# EAGLE design VIC-20_Diag_Keyboard (EAGLE 9.5.2)
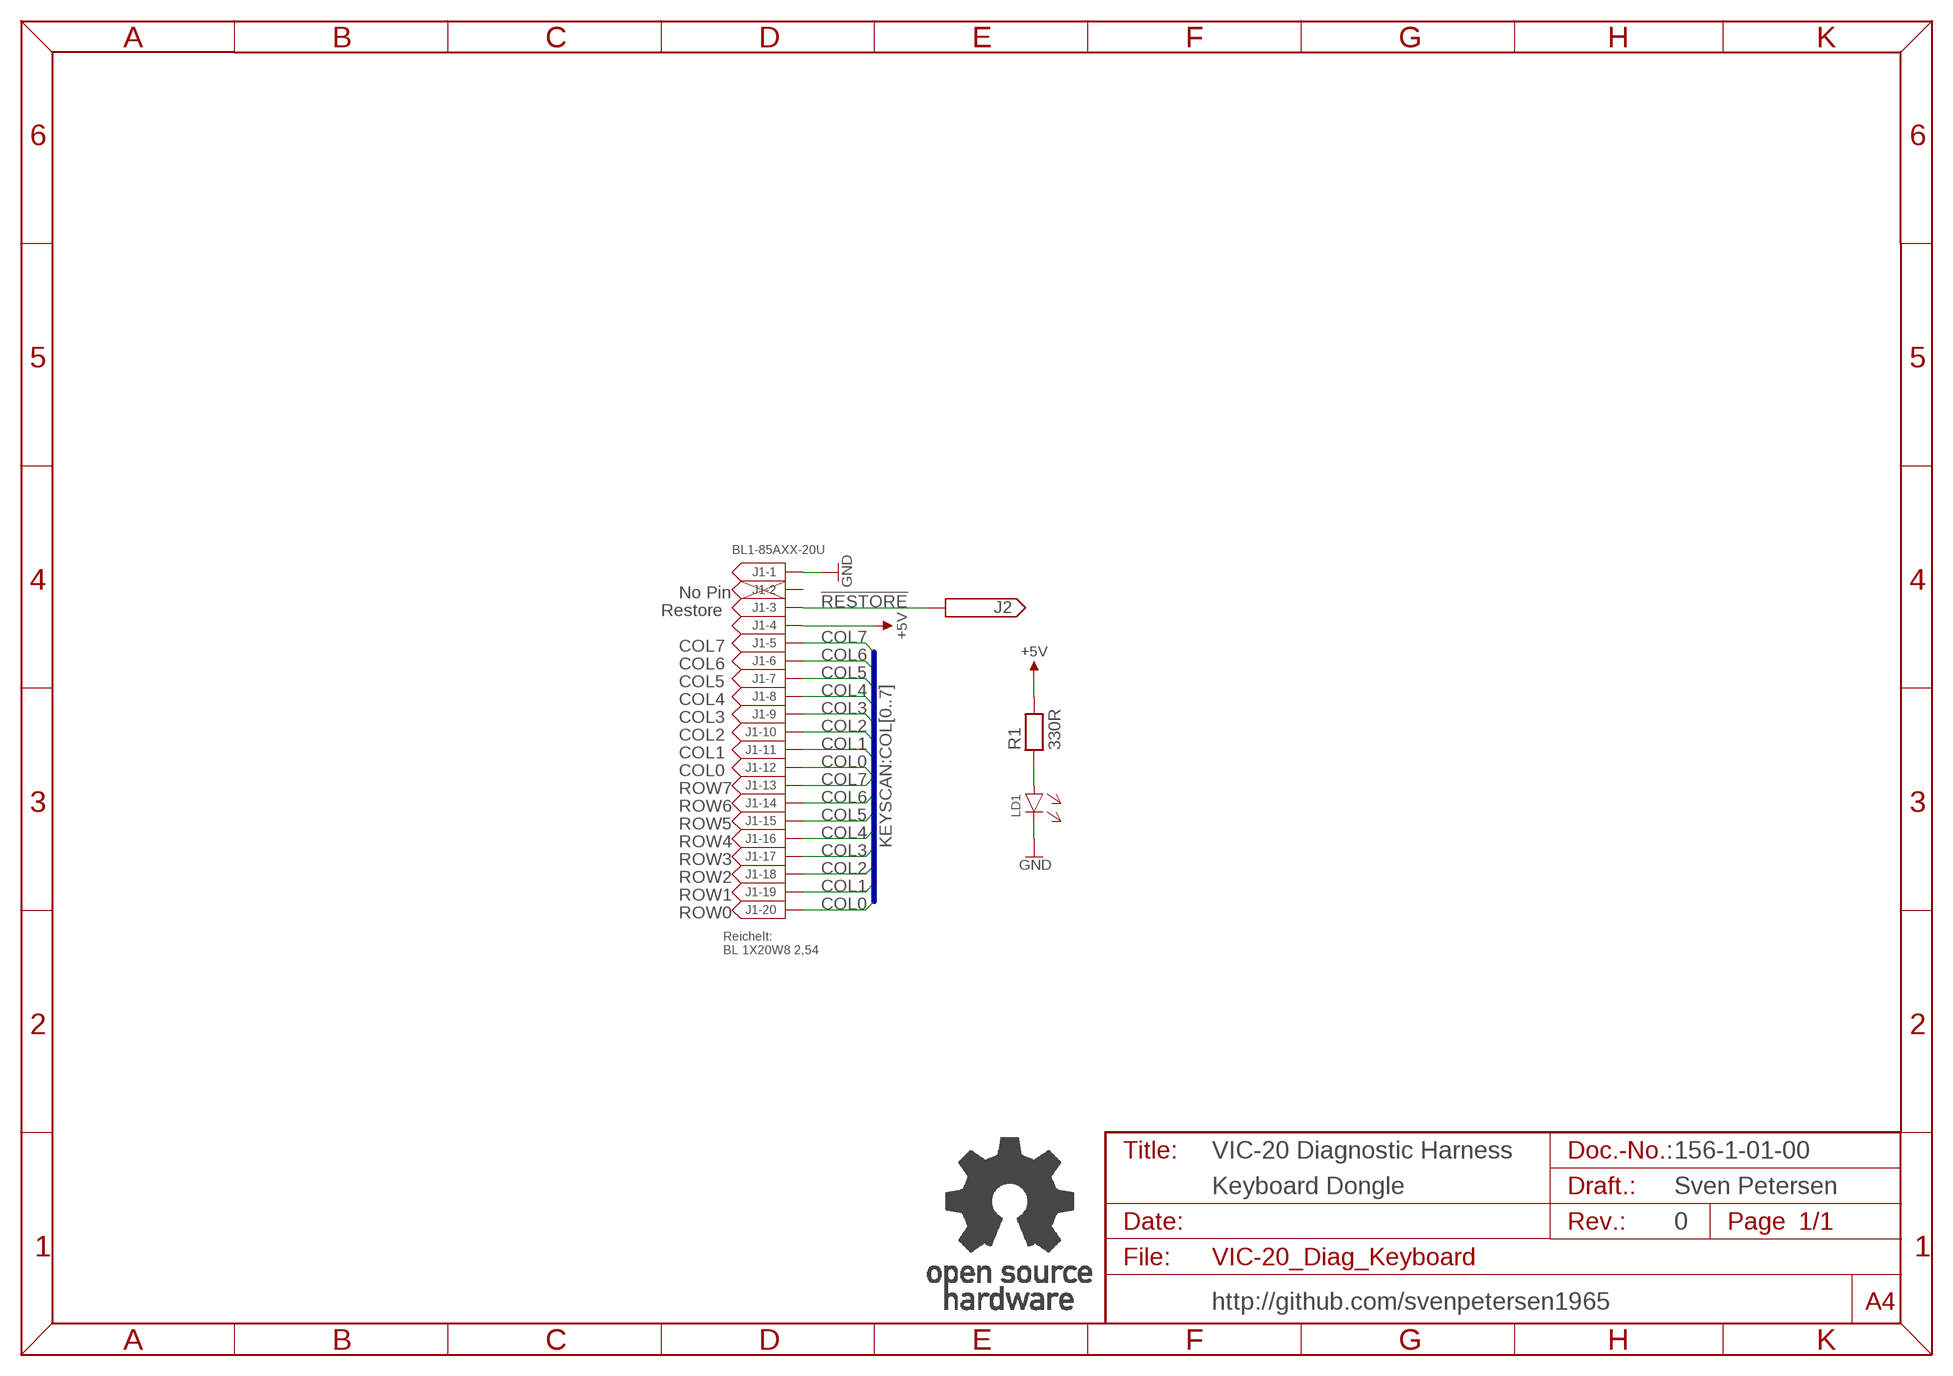
[diagram p0: schematic, sheet 1]

## Parts
J1  BL1-85AXX-20U  [BL1-85AXX-20U]
J2  PINHD-1X1  [1X01]
LD1  3MM  [3MM]
R1  330R  RES04  [R-10]
U$9  OPEN_SOURCE_HW  [OPENHW]

## Nets
!RESTORE: J1.3 J2.1
+5V: J1.4 R1.2
COL0: J1.12 J1.20
COL1: J1.11 J1.19
COL2: J1.10 J1.18
COL3: J1.9 J1.17
COL4: J1.8 J1.16
COL5: J1.7 J1.15
COL6: J1.6 J1.14
COL7: J1.5 J1.13
GND: J1.1 LD1.C(K)
N$1: LD1.A R1.1
Unconnected: J1.2

## Buses
KEYSCAN:COL[0..7]

## Notes on the sheet
- No Pin
- Restore
- COL7
- COL6
- COL5
- COL4
- COL3
- COL2
- COL1
- COL0
- ROW7
- ROW6
- ROW5
- ROW4
- ROW3
- ROW2
- ROW1
- ROW0
- Reichelt:
  BL 1X20W8 2,54
- VIC-20 Diagnostic Harness | 156-1-01-00
- Keyboard Dongle | Sven Petersen
- 0
- http://github.com/svenpetersen1965

## Library data of the parts
J1 = MPE_Garry:BL1-85AXX-20U
J2 = PINHEAD:PINHD-1X1
LD1 = LED:3MM
R1 = DISCRETE:RES04
U$9 = Logo:OPEN_SOURCE_HW

## Board
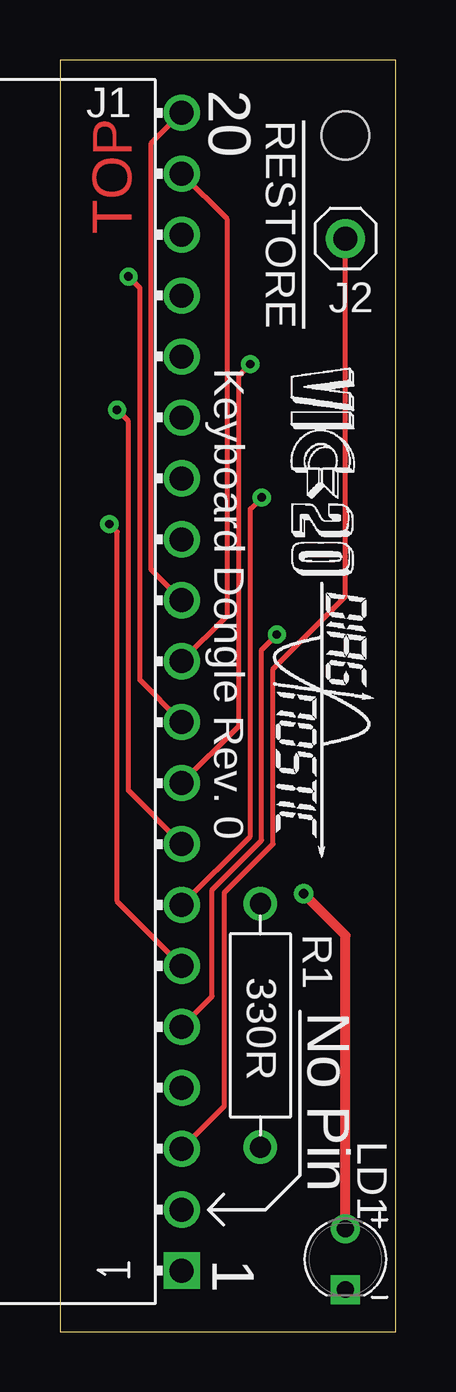
[diagram p1: board, top side]
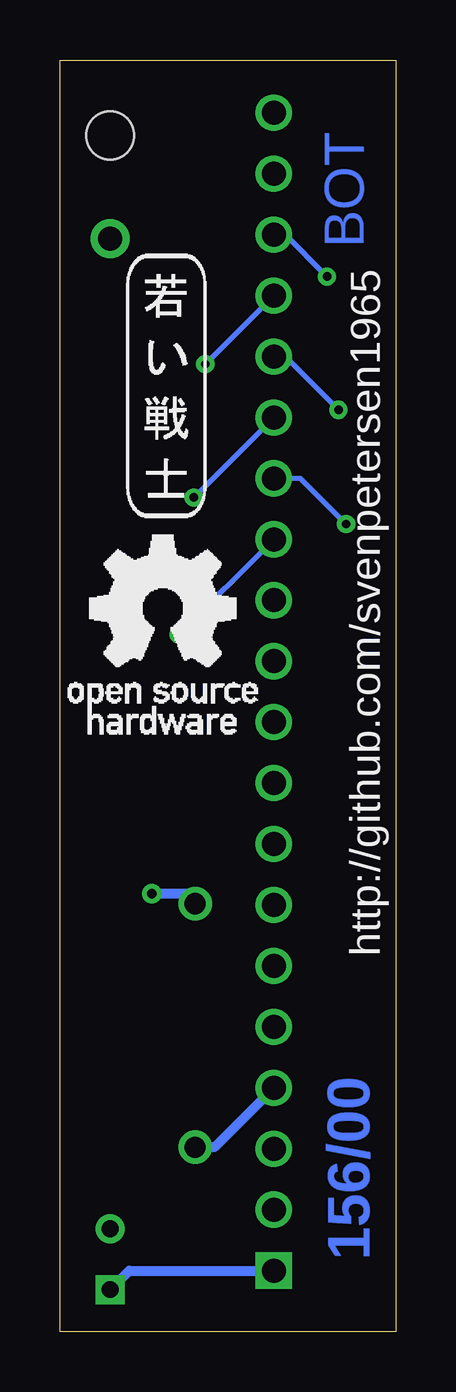
[diagram p2: board, bottom side, seen from below]

Size 14 x 53 mm. Coordinates in mm from the lower left corner, seen from the top.
Outline: 0,0 14,0 14,53 0,53 0,0
Copper layers (1*16): Top 0.035mm / dielectric 1.5mm / Bottom 0.035mm
Design rules "default *": minimum track width 6mil, minimum drill 0.35mm, track to track 6mil, track to pad 6mil, pad to pad 6mil, via to via 6mil, smd to smd 6mil, copper to edge 40mil, drill to drill 6mil, minimum pad ring 10mil, minimum via ring 8mil, stop-mask expansion 4mil, vias tented up to drill 24mil, thermal gap 10mil
Holes 2 mm at 11.91,49.85

### Footprints (pad centres in the part's own frame; a part is rotated, then mirrored left to right if it is on the bottom)
BL1-85AXX-20U = drill 1 square: 1 -24.13,0 | drill 1: 2 -21.59,0; 3 -19.05,0; 4 -16.51,0; 5 -13.97,0; 6 -11.43,0; 7 -8.89,0; 8 -6.35,0; 9 -3.81,0; 10 -1.27,0; 11 1.27,0; 12 3.81,0; 13 6.35,0; 14 8.89,0; 15 11.43,0; 16 13.97,0; 17 16.51,0; 18 19.05,0; 19 21.59,0; 20 24.13,0
1X01 = drill 1 pad 1.626: 1 0,0
3MM = drill 0.7: A -1.27,0 | drill 0.7 square: C 1.27,0
R-10 = drill 0.889 pad 1.397: 1 -5.08,0; 2 5.08,0

### Placement (x,y rotation side)
J1  5.08,26.67 90 top
J2  11.91,45.56 0 top
LD1  11.91,3.02 270 top
R1  8.36,12.76 270 top
U$6  [2LAYER]  2.99,45.73 90 top
U$7  [PCB-TITLE/]  0,60 0 top  (outside the outline)
U$8  [SVEN_TAG]  9.53,39.53 0 bottom
U$9  13.65,24.92 0 bottom
U$10  [VIC20_DIAG_SMALL]  8.89,40.16 270 top

### Tracks (layer width: path | path; a pad name or v marks a point on that pad's centre or on a via)
!RESTORE
  Top 0.203: J1.3 6.86,9.4 6.86,18.29 8.89,20.32 8.89,27.62 11.91,30.64 J2.1
+5V
  Bottom 0.406: J1.4 7.56,7.68 R1.2
COL0
  Top 0.203: J1.20 3.81,49.53 3.81,31.75 J1.12
COL1
  Top 0.203: J1.11 6.99,29.84 6.99,46.35 J1.19
COL2  (via drill 0.35)
  Top 0.203: J1.10 3.33,27.15 3.33,43.5 v2.86,43.97
  Bottom 0.203: v2.86,43.97 4.6,45.72 J1.18
COL3  (via drill 0.35)
  Top 0.203: J1.9 7.46,25.24 7.46,39.85 v7.94,40.32
  Bottom 0.203: v7.94,40.32 J1.17
COL4  (via drill 0.35)
  Top 0.203: J1.8 2.86,22.54 2.86,37.94 v2.38,38.42
  Bottom 0.203: v2.38,38.42 4.6,40.64 J1.16
COL5  (via drill 0.35)
  Top 0.203: J1.7 7.94,20.64 7.94,34.29 v8.41,34.77
  Bottom 0.203: v8.41,34.77 J1.15
COL6  (via drill 0.35)
  Top 0.203: J1.6 2.39,17.93 2.39,33.33 v2.06,33.66
  Bottom 0.203: v2.06,33.66 3.97,35.56 J1.14
COL7  (via drill 0.35)
  Top 0.203: J1.5 6.35,13.97 6.35,18.41 8.41,20.48 8.41,28.42 v9.05,29.05
  Bottom 0.203: v9.05,29.05 J1.13
GND
  Bottom 0.406: LD1.C 11.11,2.54 J1.1
N$1  (via drill 0.4)
  Top 0.406: LD1.A 11.91,16.51 v10.16,18.26
  Bottom 0.406: v10.16,18.26 8.78,18.26 R1.1

### Text on the board
Bottom: 156/00
tPlace: 20 | !RESTORE | Keyboard Dongle Rev. 0 | 330R | No Pin | 1
bPlace: http://github.com/svenpetersen1965
Document: 156-2-01-00 | Sven Petersen / 2020 | 35µm | 2 | 0